# Altium schematic sheet 5  - TSAL.SchDoc
size A4
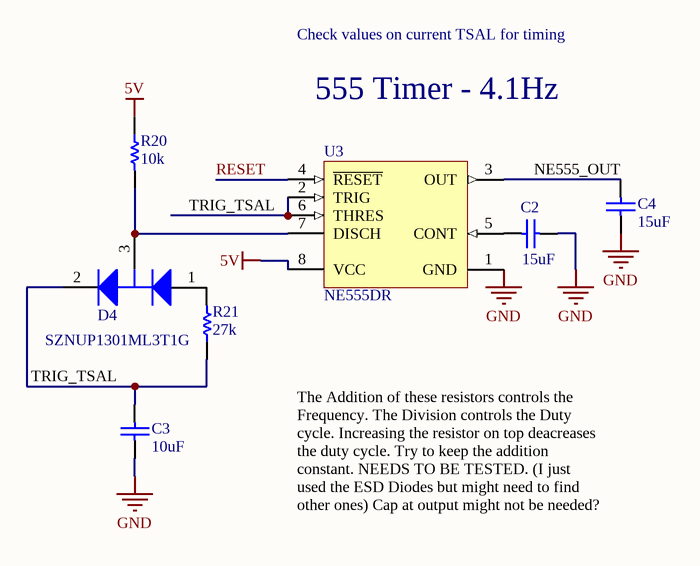
[diagram p0: 5  - TSAL.SchDoc]

## Parts
C2  value 15uF  [1608[0603]]  (hidden comment: Cap)
C3  value 10uF  [1608[0603]]  (hidden comment: Cap)
C4  value 15uF  [1608[0603]]  (hidden comment: Cap)
D4  SZNUP1301ML3T1G  [ONSC-SOT-23-3-318-08_V]
R20  10k  [RESC0603(1608)_L]
R21  27k  [RESC0603(1608)_L]
U3  NE555DR  [D0008A_M]

## Nets
5V: R20.1 U3.8(VCC)
GND: C2.2 C3.1 C4.1 U3.1(GND)
NE555_OUT: C4.2 U3.3(OUT)
RESET: U3.4(~{RESET})
TRIG_TSAL: C3.2 D4.2(K) R21.1 U3.2(TRIG) U3.6(THRES)
NetC2_1: C2.1 U3.5(CONT)
NetD4_1: D4.1(A) R21.2
NetD4_3: D4.3(K/A) R20.2 U3.7(DISCH)

## Notes on the sheet
- Check values on current TSAL for timing
- 555 Timer - 4.1Hz
- The Addition of these resistors controls the Frequency. The Division controls the Duty cycle. Increasing the resistor on top deacreases the duty cycle. Try to keep the addition constant. NEEDS TO BE TESTED. (I just used the ESD Diodes but might need to find other ones) Cap at output might not be needed? Cap from 12V to GND might be needed.

## Library data of the parts
C2-C4 = Cap: Capacitor; Published: 8-Jun-2000; LatestRevisionDate: 17-Jul-2002; LatestRevisionNote: Re-released for DXP Platform.; PackageReference: RAD-0.3; Publisher: Altium Limited; PackageDescription: Radial Cap, Thru-Hole; 2 Leads; 0.3 in Pin Spacing; Supplier 1: Digi-Key
  C2 C4: Supplier Part Number 1: 445-11189-1-ND
  C3: Supplier Part Number 1: 490-10991-1-ND
D4 = CMP-1063-00171-1: Low Capacitance Diode Array for ESD Protection in a Single Data Line, 3-Pin SOT-23, Pb-Free, Tape and Reel; Manufacturer: On Semiconductor; C Max (pF): 0.9; Direction: Bidirectional; V(BR) Min (V): 70; Number of Lines: 1; Mounting Technology: Surface Mount; PackageReference: SOT-23-3-318-08; DatasheetVersion: Rev. 6; PackageVersion: Rev. AP, 11/2009; RoHS: Pb-Free; ComponentLink1Description: Manufacturer URL; ComponentLink1URL: http://www.onsemi.com/; PackageDescription: 3-Pin Small Outline Transistor, Body 2.92 x 1.3 mm, Pitch 0.95 mm; PartNumber: SZNUP1301ML3T1G; Packing: Tape and Reel; ComponentLink3URL: http://www.onsemi.cn/pub_link/Collateral/318-08.PDF; ComponentLink3Description: Package Specification; VRWM Max (V): 70; ComponentLink2Description: Datasheet; ComponentLink2URL: http://www.onsemi.cn/pub_link/Collateral/NUP1301ML3T1-D.PDF; Supplier 1: Digi-Key; Supplier Part Number 1: SZNUP1301ML3T1GOSCT-ND
R20 R21 = CMP-1591-00001-1: 0603 (1608 Metric) Chip Resistor; Value: 1k; Case-Metric: 1608; Case-EIA: 0603; PackageReference: RESC0603(1608); Supplier 1: Digi-Key
  R20: Supplier Part Number 1: 311-10KGRCT-ND
  R21: Supplier Part Number 1: 311-27KGRCT-ND
U3 = CMP-1685-00007-1: Precision Timer, 4.5 to 16 V, 0 to 70 degC, 8-Pin SOIC (D8), Green (RoHS & no Sb/Br), Tape and Reel; Forward Voltage: 450 mV; Forward Current: 1 A; Max Surge Current: 30 A; Peak Reverse Current: 500 uA; Case\Package: SMA; PackageReference: D0008A; Width: 2.84 mm; PackageDescription: 8-Pin Small Outline Integrated Circuit, Body 4.9 x 3.9 mm, Pitch 1.27 mm; DatasheetVersion: SLFS022I, 09/2014; ComponentLink2Description: Datasheet; Package Quantity: 1; REACH SVHC: Unknown; Radiation Hardening: No; Height: 2.44 mm; Code_JEDEC: MS-012; Pins: 2; ComponentLink1Description: Manufacturer URL; ComponentLink3Description: Package Specification; ComponentLink3URL: http://www.ti.com/lit/ml/msoi002j/msoi002j.pdf; Length: 4.57 mm; ComponentLink1URL: http://www.ti.com/; Mount: Surface Mount; PackageVersion: 4040047-3/M, 06/2011; ComponentLink2URL: http://www.ti.com/general/docs/lit/getliterature.tsp?genericPartNumber=NE555&fileType=pdf; RoHSCompliant: true; Max Operating Temperature: 125 degC; Packaging: Cut Tape; Min Operating Temperature: -55 degC; Supplier 1: Digi-Key; Supplier Part Number 1: 296-6501-2-ND